# Altium schematic sheet A_INPUT.SchDoc
size A3; SheetNumber: 3; SheetTotal: 10
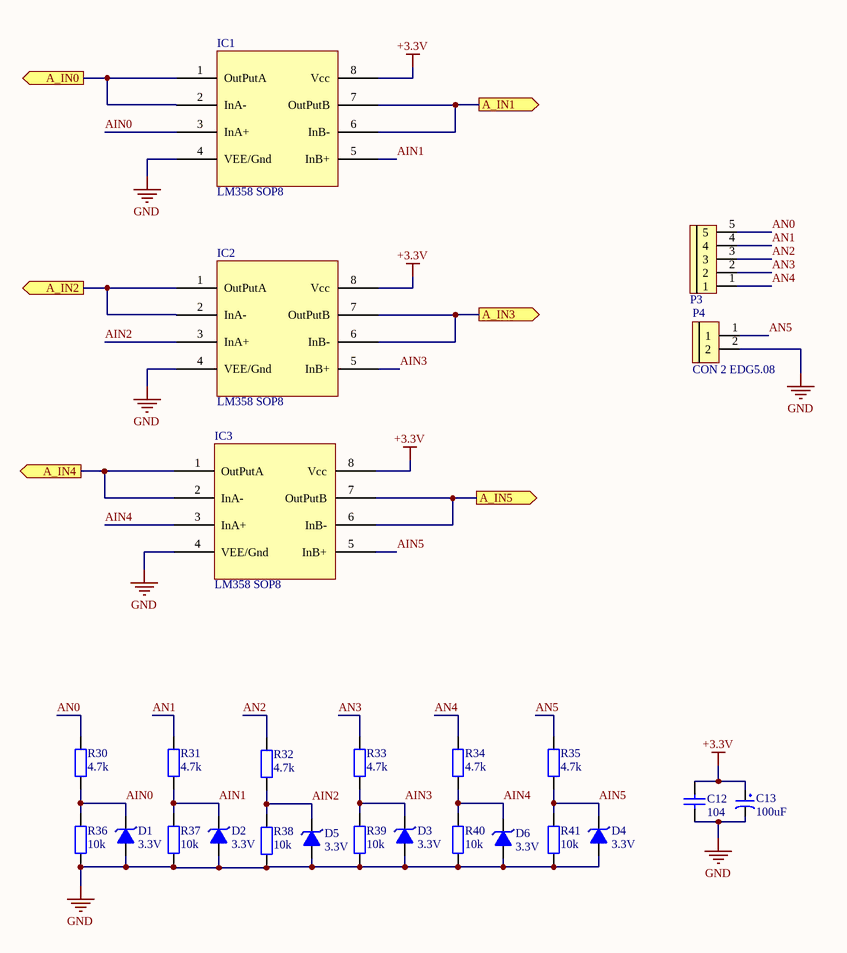
[diagram p0: A_INPUT.SchDoc]

## Parts
C12  104  [tu 0805]
C13  100uF  [tu hoa 5mm]
D1  3.3V  [DIODE ZENNER SMD SOD80]
D2  3.3V  [DIODE ZENNER SMD SOD80]
D3  3.3V  [DIODE ZENNER SMD SOD80]
D4  3.3V  [DIODE ZENNER SMD SOD80]
D5  3.3V  [DIODE ZENNER SMD SOD80]
D6  3.3V  [DIODE ZENNER SMD SOD80]
IC1  LM358 SOP8  [SOP 8]
IC2  LM358 SOP8  [SOP 8]
IC3  LM358 SOP8  [SOP 8]
P3  CON 5 EDG5.08  [CON 5 5EDG5.08]  (value not drawn)
P4  CON 2 EDG5.08  [CON 2 2EDG5.08]
R30  4.7k  [tro smd 0805]
R31  4.7k  [tro smd 0805]
R32  4.7k  [tro smd 0805]
R33  4.7k  [tro smd 0805]
R34  4.7k  [tro smd 0805]
R35  4.7k  [tro smd 0805]
R36  10k  [tro smd 0805]
R37  10k  [tro smd 0805]
R38  10k  [tro smd 0805]
R39  10k  [tro smd 0805]
R40  10k  [tro smd 0805]
R41  10k  [tro smd 0805]

## Ports
A_IN0 (out), A_IN1 (out), A_IN2 (out), A_IN3 (out), A_IN4 (out), A_IN5 (out)

## Nets
+3.3V: C12.1 C13.1 IC1.8(Vcc) IC2.8(Vcc) IC3.8(Vcc)
GND: C12.2 C13.2 D1.1(A) D2.1(A) D3.1(A) D4.1(A) D5.1(A) D6.1(A) IC1.4(VEE/Gnd) IC2.4(VEE/Gnd) IC3.4(VEE/Gnd) P4.2 R36.1 R37.1 R38.1 R39.1 R40.1 R41.1
A_IN0: IC1.1(OutPutA) IC1.2(InA-) ; port A_IN0
A_IN1: IC1.6(InB-) IC1.7(OutPutB) ; port A_IN1
A_IN2: IC2.1(OutPutA) IC2.2(InA-) ; port A_IN2
A_IN3: IC2.6(InB-) IC2.7(OutPutB) ; port A_IN3
A_IN4: IC3.1(OutPutA) IC3.2(InA-) ; port A_IN4
A_IN5: IC3.6(InB-) IC3.7(OutPutB) ; port A_IN5
AIN0: D1.2(K) IC1.3(InA+) R30.1 R36.2
AIN1: D2.2(K) IC1.5(InB+) R31.1 R37.2
AIN2: D5.2(K) IC2.3(InA+) R32.1 R38.2
AIN3: D3.2(K) IC2.5(InB+) R33.1 R39.2
AIN4: D6.2(K) IC3.3(InA+) R34.1 R40.2
AIN5: D4.2(K) IC3.5(InB+) R35.1 R41.2
AN0: P3.5 R30.2
AN1: P3.4 R31.2
AN2: P3.3 R32.2
AN3: P3.2 R33.2
AN4: P3.1 R34.2
AN5: P4.1 R35.2

## Library data of the parts
C12 = Tu 0805 104 50V 10%: Dán; Don_Vi: Con; So_Chan: 2; Ten_Linh_Kien: Tụ 0805 104-100nF 10% 50V; Ma_Hang: MH004551; Chung_Loai: Dán; Kieu_Chan: *
C13 = Tu Hoa 100uF 16V 5x7: Cắm; Don_Vi: Con; So_Chan: 2; Ten_Linh_Kien: Tụ Hóa 100uF 16V 5x7MM; Ma_Hang: MH001347; Chung_Loai: Cắm; Kieu_Chan: *
D1-D6 = Diode Zener 3.3V: Dán; Don_Vi: Con; Ma_Hang: MH002880; Ten_Linh_Kien: Diode Zener 1/2W 3.3V SMD1206 ZMM3.3; Kieu_Chan: *; Ghi_Chu: *; Chung_Loai: Dán
IC1-IC3 = LM358 SOP8: Dán; Ma_Hang: MH000609; Don_Vi: Con; Ten_Linh_Kien: LM358 SOP8; Kieu_Chan: *; Ghi_Chu: *; Chung_Loai: Dán
P3 = CON 5 EDG5.08: Cắm; Ten_Linh_Kien: CON 5 2EDG5.08-5P 5.08MM ( Xanh Cong); Ma_Hang: MH003589; Kieu_Chan: *; Don_Vi: Con; Ghi_Chu: *; Chung_Loai: Cắm
P4 = CON 2 EDG5.08: Cắm; Ten_Linh_Kien: CON 2 2EDG5.08-2P 5.08MM ( Xanh Cong); Ma_Hang: MH000759; Ghi_Chu: *; Don_Vi: Con; Kieu_Chan: *; Chung_Loai: Cắm
R30-R35 = Tro 0805 1% 5.1k: Dán; Don_Vi: Con; So_Chan: 2; Ten_Linh_Kien: Trở 0805 1% 5.1k; Ma_Hang: MH008812; Chung_Loai: Dán; Kieu_Chan: *
R36-R41 = Tro 0805 1% 10k: Dán; Don_Vi: Con; So_Chan: 2; Ten_Linh_Kien: Trở 0805 1% 10k; Ma_Hang: MH005473; Chung_Loai: Dán; Kieu_Chan: *